# Altium schematic sheet Power 3v3.SchDoc
size A4; SheetNumber: 5; SheetTotal: 7
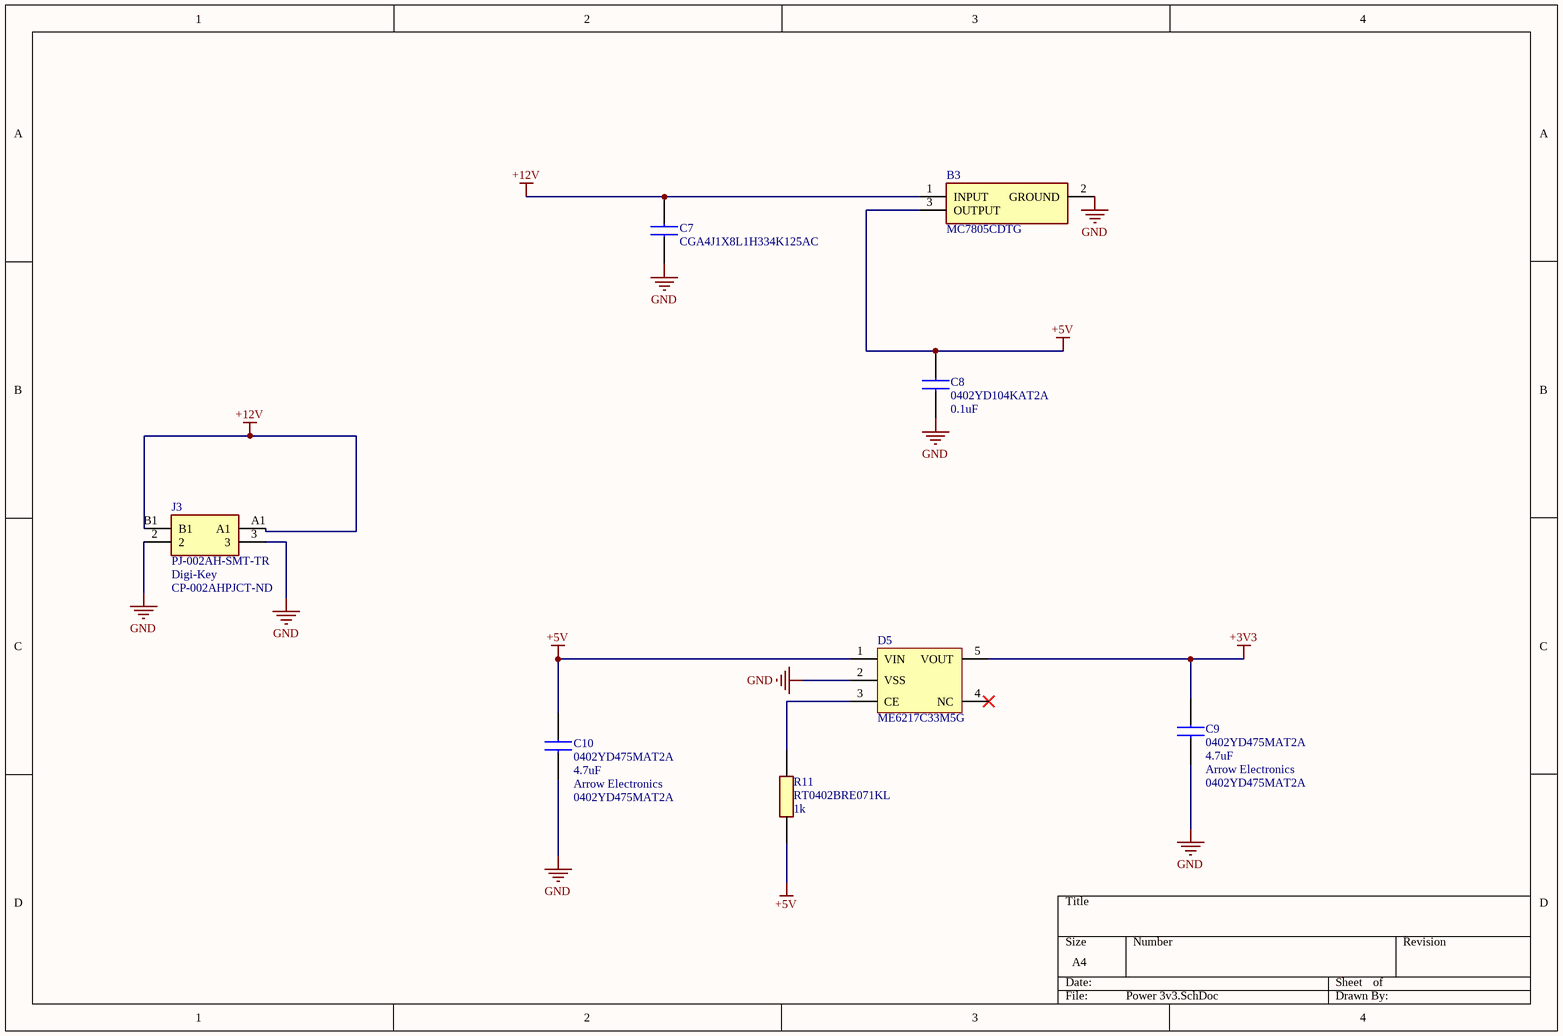
[diagram p0: Power 3v3.SchDoc]

## Parts
B3  MC7805CDTG  [MC7805CDTG]
C7  CGA4J1X8L1H334K125AC  [CAPC2012X145N]
C8  0402YD104KAT2A  value 0.1uF  [CAPC1005X40N]
C9  0402YD475MAT2A  value 4.7uF  Supplier 1: Arrow Electronics  [CAPC1005X40N]
C10  0402YD475MAT2A  value 4.7uF  Supplier 1: Arrow Electronics  [CAPC1005X40N]
D5  ME6217C33M5G  [SOT-23-5_L2.9-W1.6-P0.95-LS2.8-BR]
J3  PJ-002AH-SMT-TR  Supplier 1: Digi-Key  Supplier Part Number 1: CP-002AHPJCT-ND  [PJ002AHSMTTR]
R11  RT0402BRE071KL  value 1k  [RESC1005X40N]

## Nets
+3V3: C9.2 D5.5(VOUT)
+5V: B3.3(OUTPUT) C8.2 C10.2 D5.1(VIN) R11.1
+12V: B3.1(INPUT) C7.2 J3.A1 J3.B1
GND: B3.2(GROUND) C7.1 C8.1 C9.1 C10.1 D5.2(VSS) J3.2 J3.3
NetD5_3: D5.3(CE) R11.2

Not connected (* = marked no-connect by the designer): D5 4(NC)*

## Library data of the parts
B3 = MC7805CDTG: Linear Voltage Regulators 5V 1A Positive; Manufacturer_Name: onsemi; Geometry.Height: 2.51mm; Mouser Part Number: 863-MC7805CDTG; Mouser Price/Stock: https://www.mouser.co.uk/ProductDetail/onsemi/MC7805CDTG?qs=%252B9%2Fcbd0IE0RdeBGvK4GFRg%3D%3D; Manufacturer_Part_Number: MC7805CDTG; Datasheet Link: https://www.onsemi.com/pdf/datasheet/mc7800-d.pdf
C7 = CGA4J1X8L1H334K125AC: Multilayer Ceramic Chip Capacitors, Capacitance=0.33uF, LxWxT:2x1.25x1.25mm; Manufacturer_Name: TDK; Geometry.Height: 1.45mm; Mouser Part Number: 810-CGA4J1X8L1H334K1; Mouser Price/Stock: https://www.mouser.co.uk/ProductDetail/TDK/CGA4J1X8L1H334K125AC?qs=W%2FMpXkg%252BdQ7wXGeZmfNwXQ%3D%3D; Manufacturer_Part_Number: CGA4J1X8L1H334K125AC; Datasheet Link: *
C8 = 0402YD104KAT2A: Capacitor MLCC 0402 100nF 16V AVX 0402 Standard 100nF Ceramic Multilayer Capacitor, 16 V dc, +85C, X5R Dielectric, +/-10% SMD; Geometry.Height: 0.56mm; Mouser Part Number: 581-0402YD104K; Mouser Price/Stock: https://www.mouser.co.uk/ProductDetail/AVX/0402YD104KAT2A?qs=fS3i9m8Z%2FmrV7G1UZb6Y7g%3D%3D; Manufacturer_Name: AVX; Manufacturer_Part_Number: 0402YD104KAT2A; Datasheet Link: *; Supplier Part Number 1: 0402YD104KAT2A; Supplier 1: Avnet
C9 C10 = 0402YD475MAT2A: Multilayer Ceramic Capacitors MLCC - SMD/SMT 16V 4.7uF 20% X5R 0402; Manufacturer_Name: AVX; Geometry.Height: 0.71mm; Mouser Part Number: 581-0402YD475MAT2A; Mouser Price/Stock: https://www.mouser.co.uk/ProductDetail/AVX/0402YD475MAT2A?qs=s6nfgz3miVxwCmHE9M6tUg%3D%3D; Manufacturer_Part_Number: 0402YD475MAT2A; Datasheet Link: *; Supplier Part Number 1: 0402YD475MAT2A
D5 = ME6217C33M5G / SOT23-5
J3 = PJ-002AH-SMT-TR: DC Power Connectors Power Jacks; Manufacturer_Name: CUI Devices; Geometry.Height: 11.23mm; Mouser Part Number: 490-PJ-002AH-SMT-TR; Mouser Price/Stock: https://www.mouser.co.uk/ProductDetail/CUI-Devices/PJ-002AH-SMT-TR?qs=WyjlAZoYn52i5LSWfoFS9w%3D%3D; Manufacturer_Part_Number: PJ-002AH-SMT-TR; Datasheet Link: https://www.cuidevices.com/product/resource/pj-002ah-smt-tr.pdf
R11 = RT0402BRE071KL: Thin Film Resistors - SMD 1/16W 1K ohm .1% 50ppm; Manufacturer_Name: YAGEO; Geometry.Height: 0.4mm; Mouser Part Number: 603-RT0402BRE071KL; Mouser Price/Stock: https://www.mouser.co.uk/ProductDetail/YAGEO/RC0402FR-0710KL?qs=I1mnnYJTTsxUoNwrUsQExA%3D%3D; Manufacturer_Part_Number: RT0402BRE071KL; Datasheet Link: https://componentsearchengine.com/Datasheets/2/RC0402FR-0710KL.pdf; Supplier 1: Future Electronics; Supplier Part Number 1: 3025706